# EAGLE design filaSens (EAGLE 7.2.0)
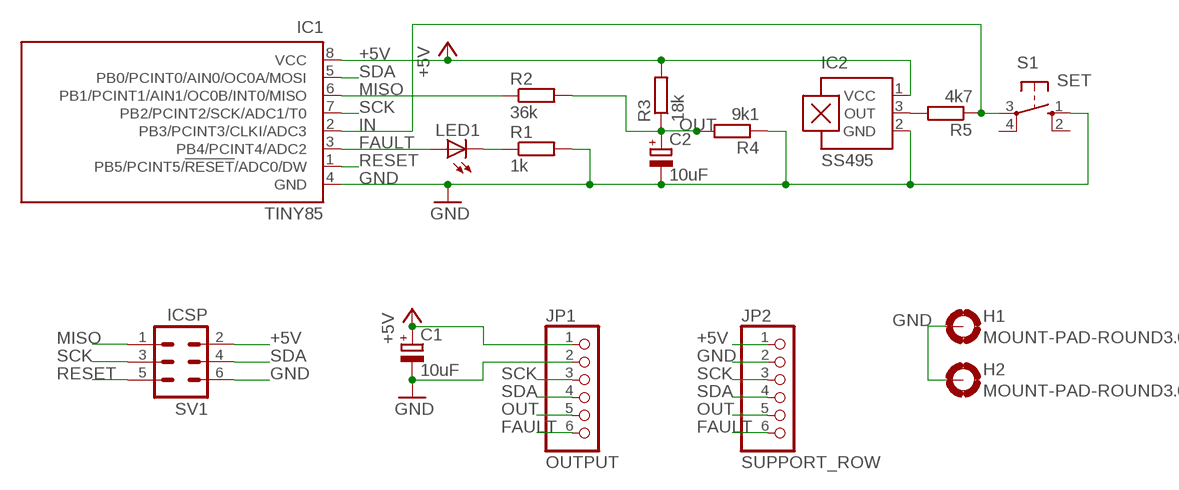
[diagram p0: schematic, sheet 1]

## Parts
C1  10uF  CPOL-EUE2.5-5  [E2,5-5]
C2  10uF  CPOL-EUE2.5-5  [E2,5-5]
H1  MOUNT-PAD-ROUND3.0  [3,0-PAD]
H2  MOUNT-PAD-ROUND3.0  [3,0-PAD]
IC1  TINY85  TINY13-20PU  [DIL08]
IC2  SS495  A1302UA  [SIP3-UA]
JP1  OUTPUT  PINHD-1X6  [1X06]
JP2  SUPPORT_ROW  PINHD-1X6  [1X06]
LED1  TLLG4400  [LED3MM]
R1  1k  R-EU_0207/10  [0207/10]
R2  36k  R-EU_0207/10  [0207/10]
R3  18k  R-EU_0207/10  [0207/10]
R4  9k1  R-EU_0207/10  [0207/10]
R5  4k7  R-EU_0207/10  [0207/10]
S1  SET  10-XX  [B3F-10XX]
SV1  ICSP  MA03-2  [MA03-2]

## Nets
+5V [power]: C1.+ IC1.8(VCC) IC2.1(VCC) JP1.1 JP2.1 R3.2 SV1.2
FAULT: IC1.3(PB4/PCINT4/ADC2) JP1.6 JP2.6 LED1.A
GND [power]: C1.- C2.- H1.B3,0(MOUNT) H2.B3,0(MOUNT) IC1.4(GND) IC2.2(GND) JP1.2 JP2.2 R1.2 R4.1 S1.1(S) SV1.6
IN: IC1.2(PB3/PCINT3/CLKI/ADC3) R5.1 S1.3(P)
MISO: IC1.6(PB1/PCINT1/AIN1/OC0B/INT0/MISO) R2.1 SV1.1
N$1: IC2.3(OUT) R5.2
N$5: LED1.K(C) R1.1
OUT: C2.+ JP1.5 JP2.5 R2.2 R3.1 R4.2
RESET: IC1.1(PB5/PCINT5/!RESET!/ADC0/DW) SV1.5
SCK: IC1.7(PB2/PCINT2/SCK/ADC1/T0) JP1.3 JP2.3 SV1.3
SDA: IC1.5(PB0/PCINT0/AIN0/OC0A/MOSI) JP1.4 JP2.4 SV1.4
Unconnected: S1.2(S1) S1.4(P1)

## Library data of the parts
C1 C2 = resistor:CPOL-EU: POLARIZED CAPACITOR, European symbol
H1 H2 = holes:MOUNT-PAD-ROUND: MOUNTING PAD, round
IC1 = atmel:TINY13: 8-bit AVR Microcontroller with 1K Bytes In-System Programmable Flash Source: http://www.atmel.com/dyn/resources/prod_documents/2535S.pdf; MPN: ATTINY13-20PU; OC_FARNELL: 9171550; OC_NEWARK: 96K6521
IC2 = allegro:A13*?: Linear Hall Effect Sensor ICs Continuous-Time Ratiometric High-Temperature Operation Programmable Linear with Analog Output A1302 -Replacement- UGN3503 Source: http://www.allegromicro.com/en/Products/Part_Numbers/1301/1301.pdf http://www.allegromicro.com/en/Products/Part_Numbers/1321/1321.pdf http://www.allegromicro.com/en/Products/Part_Numbers/1381/1381.pdf; MF: ALLEGRO MICROSYSTEMS, INC.; MPN: A1302EUA-T; OC_FARNELL: 1521708; OC_NEWARK: 31K6639
JP1 JP2 = pinhead:PINHD-1X6: PIN HEADER
LED1 = led:TLLG4400: Low Current (2mA) LED 3 mm Tinted Diffused Package color GREEN Source: Data sheet <http://www.farnell.com/datasheets/391098.pdf>; MF: VISHAY SEMICONDUCTOR; OC_FARNELL: 1612435
R1-R5 = resistor:R-EU_: RESISTOR, European symbol
S1 = switch-omron:10-XX: OMRON SWITCH; MPN: B3F-1000; OC_FARNELL: 176432; OC_NEWARK: 36M3542
SV1 = con-lstb:MA03-2: PIN HEADER; OC_FARNELL: unknown; OC_NEWARK: unknown

## Net classes
0 default: width 0.254 mm
1 power: width 0.508 mm

## Board
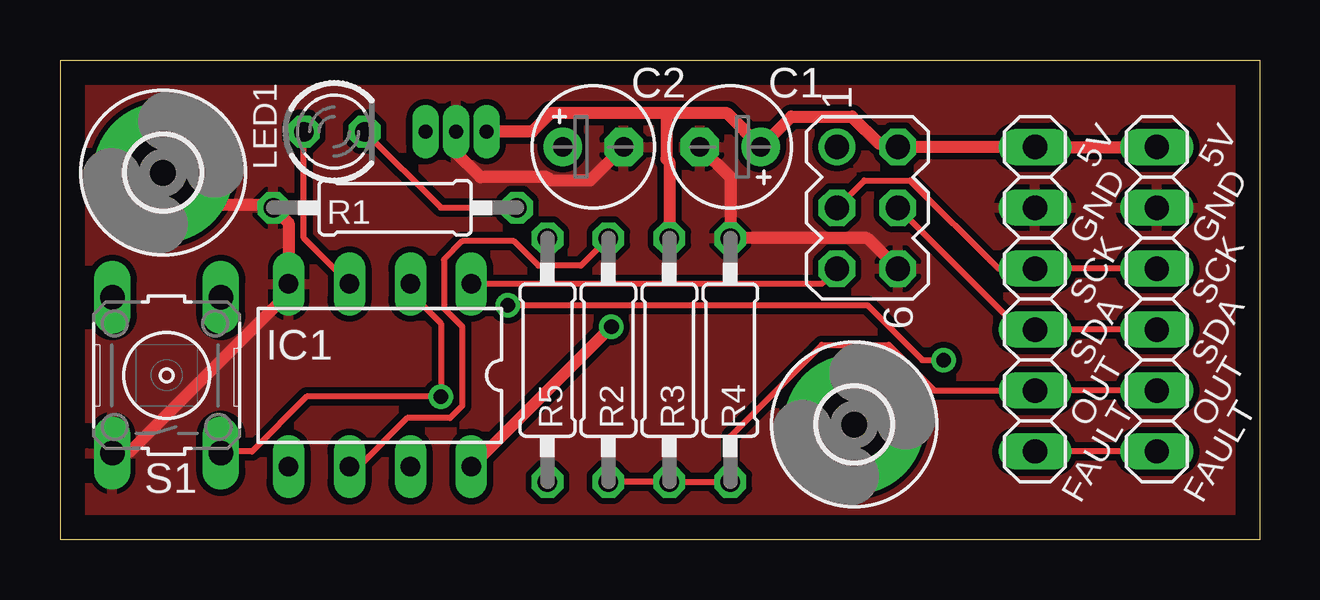
[diagram p1: board, top side]
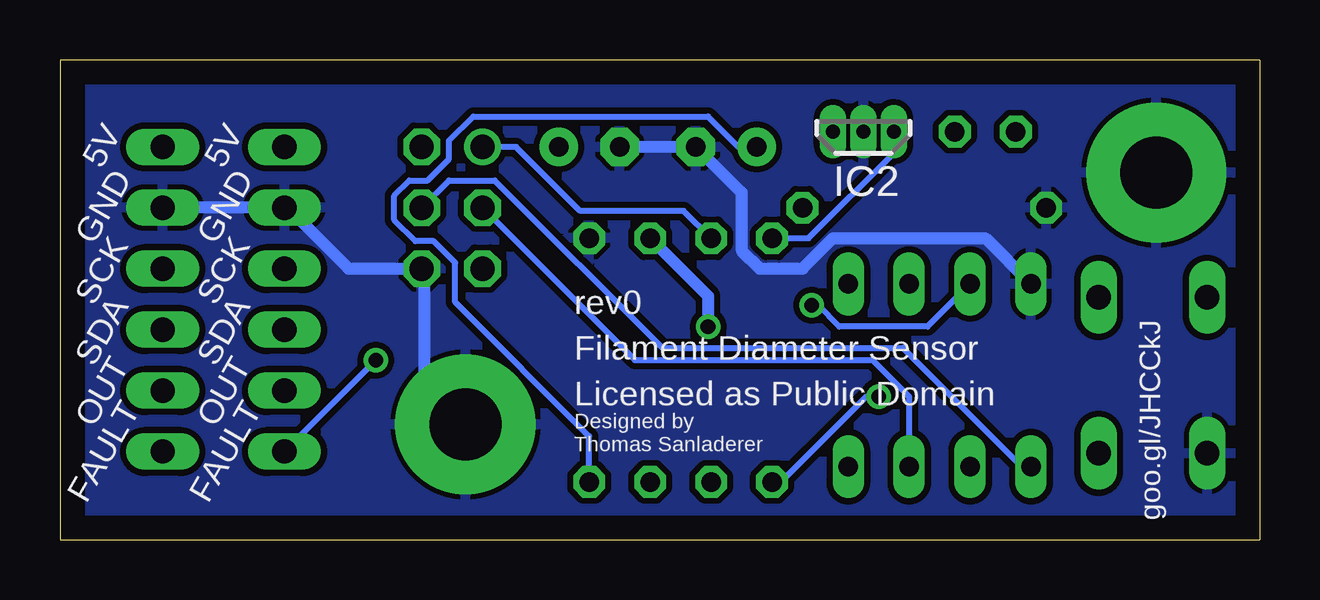
[diagram p2: board, bottom side, seen from below]

Size 50 x 20 mm. Coordinates in mm from the lower left corner, seen from the top.
Outline: 0,20 0,0 50,0 50,20 0,20
Copper layers (1*16): Top 0.035mm / dielectric 1.5mm / Bottom 0.035mm
Design rules "default *": minimum track width 10mil, minimum drill 24mil, track to track 10mil, track to pad 10mil, pad to pad 12mil, via to via 12mil, smd to smd 8mil, copper to edge 40mil, drill to drill 8mil, minimum pad ring 10mil, minimum via ring 8mil, stop-mask expansion 4mil, vias tented up to drill 28mil, thermal gap 8mil

### Footprints (pad centres in the part's own frame; a part is rotated, then mirrored left to right if it is on the bottom)
E2,5-5 = drill 0.813 pad 1.6: + -1.27,0 | drill 0.813 pad 1.6 octagon: - 1.27,0
3,0-PAD = drill 3 pad 5.842: B3,0 0,0
DIL08 = drill 0.813 long: 1 -3.81,-3.81; 2 -1.27,-3.81; 3 1.27,-3.81; 4 3.81,-3.81; 5 3.81,3.81; 6 1.27,3.81; 7 -1.27,3.81; 8 -3.81,3.81
SIP3-UA = drill 0.6 pad 0.7 long: 1 -1.27,0; 2 0,0; 3 1.27,0
1X06 = drill 1.016 long: 1 -6.35,0; 2 -3.81,0; 3 -1.27,0; 4 1.27,0; 5 3.81,0; 6 6.35,0
LED3MM = drill 0.813 octagon: A -1.27,0; K 1.27,0
0207/10 = drill 0.813 octagon: 1 -5.08,0; 2 5.08,0
B3F-10XX = drill 1.016 long: 1 -3.251,2.261; 2 3.251,2.261; 3 -3.251,-2.261; 4 3.251,-2.261
MA03-2 = drill 1.016: 1 -2.54,-1.27 | drill 1.016 octagon: 2 -2.54,1.27; 3 0,-1.27; 4 0,1.27; 5 2.54,-1.27; 6 2.54,1.27

### Placement (x,y rotation side)
C1  27.94,16.38 180 top
C2  22.23,16.38 0 top
H1  33.1,4.8 0 top
H2  4.3,15.3 0 top
IC1  13.34,6.85 180 top
IC2  16.51,17.01 0 bottom
JP1  40.64,10.03 270 top
JP2  45.72,10.03 270 top
LED1  11.43,17.01 0 top
R1  13.97,13.84 180 top
R2  22.86,7.49 270 top
R3  25.4,7.49 90 top
R4  27.94,7.49 270 top
R5  20.32,7.49 90 top
S1  4.45,6.85 90 top
SV1  33.66,13.84 270 top

### Tracks (layer width: path | path; a pad name or v marks a point on that pad's centre or on a via)
+5V  (via drill 0.61)
  Top 0.508: v22.99,8.88 IC1.8 | JP2.1 JP1.1 SV1.2 34.8,16.5 34.16,16.5 33.02,17.64 30.48,17.64 C1.+ 27.81,17.77 25.27,17.77 | IC2.1 19.68,17.01 20.45,17.77 25.27,17.77 | R3.2 25.4,15.74 25.27,15.87 25.27,17.77
  Bottom 0.508: v22.99,8.88 22.99,10.15 R3.2
FAULT  (via drill 0.61)
  Top 0.254: JP2.6 JP1.6 | LED1.A 10.16,12.56 IC1.3 | v36.83,7.49 35.94,7.49 33.66,9.77 v18.67,9.77
  Bottom 0.254: v36.83,7.49 JP1.6 | v18.67,9.77 18.41,9.77 17.53,8.88 13.84,8.88 IC1.3
GND
  Top 0.508: S1.1 2.29,3.67 2.92,3.67 9.4,10.15 9.4,10.53 IC1.4 9.53,13.2 R1.2 8.76,13.96 5.59,13.96 4.32,15.23 | C1.- 27.94,15.11 R4.1 33.66,12.56 SV1.6 | IC2.2 16.51,16.12 17.53,15.11 20.32,15.11 20.45,14.98 22.1,14.98 C2.-
  Bottom 0.508: C1.- C2.- 21.59,14.47 21.59,12.06 20.83,11.29 19.05,11.29 17.78,12.56 11.43,12.56 IC1.4 | JP2.2 JP1.2 40.51,13.84 37.97,11.29 SV1.6 34.8,11.17 34.8,6.47 33.15,4.82
  pour Bottom: 0,20 50,20 50,0 0,0
  pour Top: 0,20 50,20 50,0 0,0
IN  (via drill 0.61)
  Top 0.254: IC1.2 14.61,10.28 15.88,9.01 v15.88,5.96 10.29,5.96 8,3.67 6.73,3.67 S1.3
  Bottom 0.254: R5.1 19.94,2.4 16.38,5.96 v15.88,5.96
MISO
  Top 0.254: IC1.6 12.45,3.04 14.48,5.07 16.26,5.07 16.76,5.58 16.76,8.88 16,9.64 16,11.68 16.76,12.44 18.92,12.44 19.94,11.42 21.72,11.42 R2.1
  Bottom 0.254: SV1.1 30.99,16.38 28.32,13.71 24,13.71 R2.1
N$1
  Bottom 0.254: IC2.3 15.24,16.12 18.8,12.56 R5.2
N$5
  Top 0.254: R1.1 15.88,13.84 LED1.K
OUT
  Top 0.254: JP2.5 JP1.5 36.45,6.21 34.54,8.12 31.75,8.12 27.94,4.31 R4.2 R3.1 R2.2
  Bottom 0.254: C2.+ 21.72,16.38 22.99,17.64 32.77,17.64 33.78,16.63 33.78,15.87 34.67,14.98 35.43,14.98 36.07,14.34 36.07,13.33 35.18,12.44 34.42,12.44 33.53,11.55 33.53,9.9 27.94,4.31 R4.2
RESET
  Top 0.254: IC1.1 31.75,10.66 SV1.5
SCK
  Top 0.254: JP2.3 JP1.3 39.12,11.29 35.43,14.98 33.53,14.98 SV1.3
  Bottom 0.254: IC1.7 14.61,5.96 16.13,7.49 26.04,7.49 SV1.3
SDA
  Top 0.254: JP2.4 JP1.4 40.01,8.76 SV1.4
  Bottom 0.254: IC1.5 9.91,3.04 14.86,7.99 24.89,7.99 31.88,14.98 33.78,14.98 SV1.4

### Text on the board
tNames: 5V | 5V | GND | GND | SCK | SCK | SDA | SDA | OUT | OUT | FAULT | FAULT
bNames: 5V | 5V | GND | GND | SCK | SCK | rev0 | Filament Diameter Sensor | SDA | SDA | Licensed as Public Domain | OUT | OUT | Designed by / Thomas Sanladerer | goo.gl/JHCCkJ | FAULT | FAULT